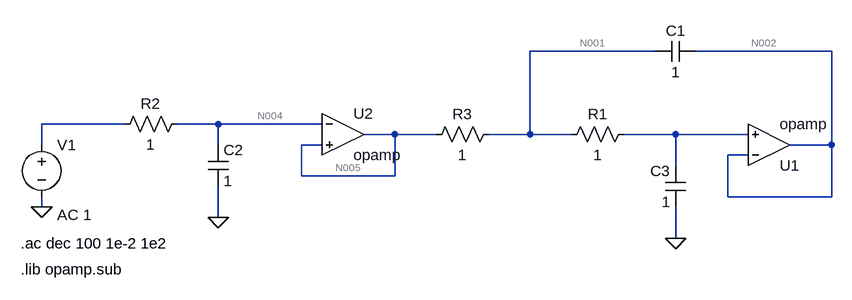
[diagram p0: schematic TS3_sk.asc]
TS3_sk.asc, the LTspice schematic file:
Version 4
SHEET 1 1096 680
WIRE 560 -80 368 -80
WIRE 832 -80 624 -80
WIRE -256 32 -384 32
WIRE -112 32 -176 32
WIRE 48 32 -112 32
WIRE 160 48 112 48
WIRE 224 48 160 48
WIRE 368 48 368 -80
WIRE 368 48 304 48
WIRE 432 48 368 48
WIRE 592 48 512 48
WIRE 704 48 592 48
WIRE -384 64 -384 32
WIRE -112 64 -112 32
WIRE 48 64 16 64
WIRE 832 64 832 -80
WIRE 832 64 768 64
WIRE 704 80 672 80
WIRE 592 96 592 48
WIRE 16 112 16 64
WIRE 160 112 160 48
WIRE 160 112 16 112
WIRE 672 144 672 80
WIRE 832 144 832 64
WIRE 832 144 672 144
WIRE -384 160 -384 144
WIRE -112 176 -112 128
WIRE 592 208 592 160
FLAG 592 208 0
FLAG -384 160 0
FLAG -112 176 0
SYMBOL voltage -384 48 R0
WINDOW 123 24 124 Left 2
WINDOW 39 0 0 Left 2
SYMATTR Value2 AC 1
SYMATTR InstName V1
SYMATTR Value ""
SYMBOL Opamps\\opamp 736 128 M180
SYMATTR InstName U1
SYMBOL res -160 16 R90
WINDOW 0 0 56 VBottom 2
WINDOW 3 32 56 VTop 2
SYMATTR InstName R2
SYMATTR Value 1
SYMBOL cap -128 64 R0
SYMATTR InstName C2
SYMATTR Value 1
SYMBOL cap 624 -96 R90
WINDOW 0 0 32 VBottom 2
WINDOW 3 32 32 VTop 2
SYMATTR InstName C1
SYMATTR Value 1
SYMBOL res 528 32 R90
WINDOW 0 0 56 VBottom 2
WINDOW 3 32 56 VTop 2
SYMATTR InstName R1
SYMATTR Value 1
SYMBOL res 320 32 R90
WINDOW 0 0 56 VBottom 2
WINDOW 3 32 56 VTop 2
SYMATTR InstName R3
SYMATTR Value 1
SYMBOL cap 608 160 R180
WINDOW 0 24 56 Left 2
WINDOW 3 24 8 Left 2
SYMATTR InstName C3
SYMATTR Value 1
SYMBOL Opamps\\opamp 80 -16 R0
SYMATTR InstName U2
TEXT -416 216 Left 2 !.ac dec 100 1e-2 1e2
TEXT -416 256 Left 2 !.lib opamp.sub

The netlist it stands for:
* TS3_sk.asc
V1 N003 0 AC 1
XU1 N002 N006 N002 opamp Aol=100K GBW=10Meg  ; pins invin noninvin out
R2 N004 N003 1
C2 N004 0 1
C1 N002 N001 1
R1 N006 N001 1
R3 N001 N005 1
C3 0 N006 1
XU2 N004 N005 N005 opamp Aol=100K GBW=10Meg  ; pins invin noninvin out
.ac dec 100 1e-2 1e2
.lib opamp.sub
.backanno
.end

* Results of the author's LTspice run, read from the files saved beside the schematic
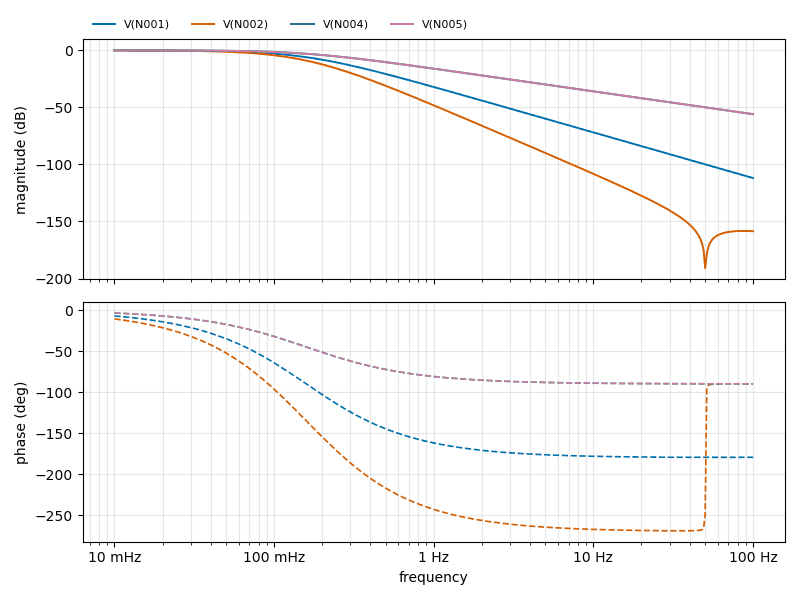
[diagram p1: AC Analysis of TS3_sk.asc, plotted from the saved traces]
* AC Analysis, 1 run:
*   V(N001): -0.03 dB at 10 mHz, -111.93 dB at 100 Hz, peak -0.03 dB at 10 mHz, 3 dB below the peak at 103.1 mHz
*   V(N002): -0.05 dB at 10 mHz, -158.50 dB at 100 Hz, peak -0.05 dB at 10 mHz, 3 dB below the peak at 81.91 mHz
*   V(N004): -0.02 dB at 10 mHz, -55.96 dB at 100 Hz, peak -0.02 dB at 10 mHz, 3 dB below the peak at 159.8 mHz
*   V(N005): -0.02 dB at 10 mHz, -55.96 dB at 100 Hz, peak -0.02 dB at 10 mHz, 3 dB below the peak at 159.8 mHz